# Altium schematic sheet module 6_MIC.SchDoc
size A4
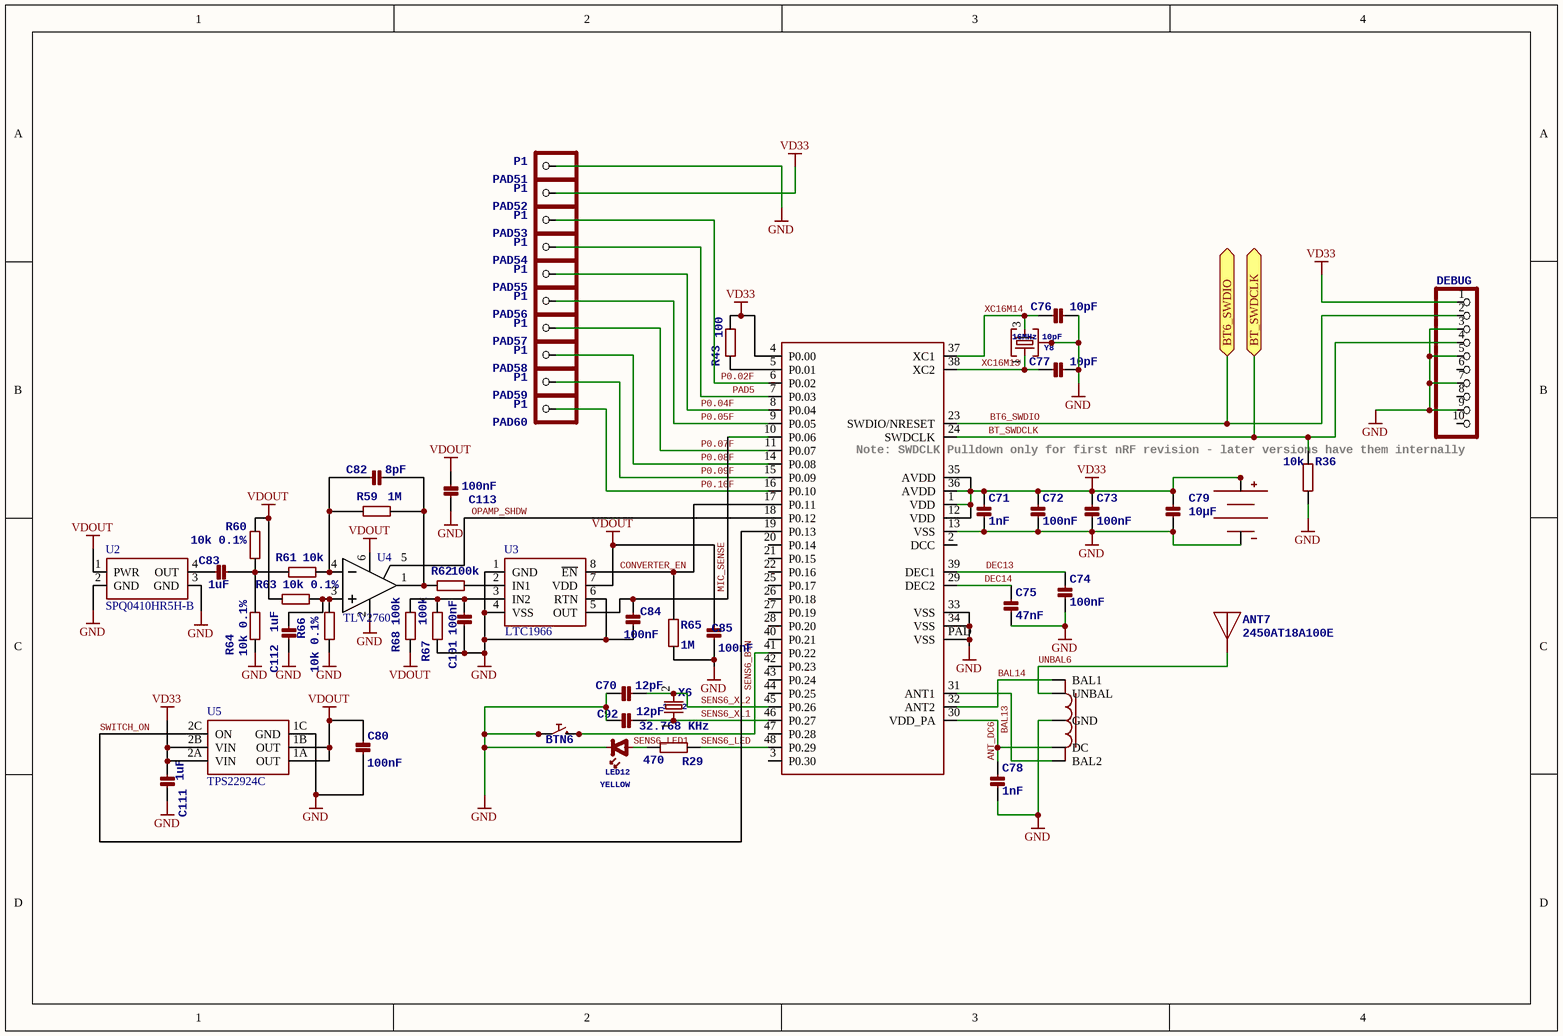
[diagram p0: module 6_MIC.SchDoc]

## Parts
ANT7  2450AT18A100E  [1206_MINIMELF_COMBO]
BALUN6  2450BM14A0002T  [6-PIN-0603]  (value not drawn)
BAT3  BATTERYBK-912  [BK-912]  (value not drawn)
BT6  NRF51822QFN48  [QFN48_EP]  (value not drawn)
BTN6  Tact Sw 4.6x2.8  [CK-KMR2]  (value not drawn)
C70  12pF  [0402]
C71  1nF  [0402]
C72  100nF  [0402]
C73  100nF  [0402]
C74  100nF  [0402]
C75  47nF  [0402]
C76  10pF  [0402]
C77  10pF  [0402]
C78  1nF  [0402]
C79  10µF  [0603]
C80  100nF  [0402]
C82  8pF  [0402]
C83  1uF  [0402]
C84  100nF  [0402]
C85  100nF  [0402]
C92  12pF  [0402]
C101  100nF  [0402]
C111  1uF  [0402]
C112  1uF  [0402]
C113  100nF  [0402]
DEBUG6  DEBUG  [2X05_SMT]  (no BOM)
LED12  YELLOW  [0402_POLAR]
PAD51  P1  [PCB_MEDIUM_RECT_PAD]  (no BOM)
PAD52  P1  [PCB_MEDIUM_RECT_PAD]  (no BOM)
PAD53  P1  [PCB_MEDIUM_RECT_PAD]  (no BOM)
PAD54  P1  [PCB_MEDIUM_RECT_PAD]  (no BOM)
PAD55  P1  [PCB_MEDIUM_RECT_PAD]  (no BOM)
PAD56  P1  [PCB_MEDIUM_RECT_PAD]  (no BOM)
PAD57  P1  [PCB_MEDIUM_RECT_PAD]  (no BOM)
PAD58  P1  [PCB_MEDIUM_RECT_PAD]  (no BOM)
PAD59  P1  [PCB_MEDIUM_RECT_PAD]  (no BOM)
PAD60  P1  [PCB_MEDIUM_RECT_PAD]  (no BOM)
R29  470  [0402]
R36  10k  [0402]
R43  100  [0402]
R59  1M  [0603]
R60  10k 0.1%  [0402]
R61  10k  [0603]
R62  100k  [0402]
R63  10k 0.1%  [0402]
R64  10k 0.1%  [0402]
R65  1M  [0402]
R66  10k 0.1%  [0402]
R67  100k  [0402]
R68  100k  [0402]
U2  SPQ0410HR5H-B  [SPQ0410HR5H-B]
U3  LTC1966  [MSOP-8]
U4  TLV2760  [DBV-6]
U5  TPS22924C  [YZP-6]
X6  32.768 KHz  [1206_MINIMELF_COMBO]
Y8  16MHz 10pF  [CRYSTAL25X20]

## Ports
BT6_SWDIO, BT_SWDCLK

## Nets
GND: BALUN6.2(GND) BAT3.- BT6.13(VSS) BT6.33(VSS) BT6.34(VSS) BT6.PAD(VSS) BTN6.P1 BTN6.P2 C70.1 C71.2 C72.2 C73.2 C74.2 C75.2 C76.2 C77.2 C78.2 C79.2(P2) C80.1 C84.1 C85.1 C92.1 C101.1 C111.2 C112.1 C113.1 DEBUG6.3 DEBUG6.5 DEBUG6.7 DEBUG6.9 LED12.K(CATHODE) PAD51.1 R36.1 R64.2 R65.2 R66.1 R67.1 U2.2(GND) U2.3(GND) U3.1(GND) U3.4(VSS) U3.6(RTN) U4.2(GND) U5.1C(GND) Y8.2 Y8.4
VD33: BAT3.+1(+) BAT3.+2(+) BT6.1(VDD) BT6.4(P0.00) BT6.12(VDD) BT6.35(AVDD) BT6.36(AVDD) C71.1 C72.1 C73.1 C79.1(P1) C111.1 DEBUG6.1 PAD52.1 R43.1 U5.2A(VIN) U5.2B(VIN)
VDOUT: C80.2 C85.2 C113.2 R60.1 R63.1 R68.1 U2.1(PWR) U3.7(VDD) U4.6(V+) U5.1A(OUT) U5.1B(OUT)
ANT_DC6: BALUN6.5(DC) BT6.30(VDD_PA) C78.1
BAL13: BALUN6.4(BAL2) BT6.31(ANT1)
BAL14: BALUN6.3(BAL1) BT6.32(ANT2)
BT6_SWDIO: BT6.23(SWDIO/NRESET) DEBUG6.2 ; port BT6_SWDIO
BT_SWDCLK: BT6.24(SWDCLK) DEBUG6.4 R36.2 ; port BT_SWDCLK
CONVERTER_EN: BT6.17(P0.11) R65.1 U3.8(~{EN})
DEC13: BT6.39(DEC1) C74.1
DEC14: BT6.29(DEC2) C75.1
MIC_SENSE: BT6.10(P0.06) C84.2 U3.5(OUT)
OPAMP_SHDW: BT6.18(P0.12) U4.5(~{SHD})
P0.02F: BT6.6(P0.02) PAD53.1
P0.04F: BT6.8(P0.04) PAD55.1
P0.05F: BT6.9(P0.05) PAD56.1
P0.07F: BT6.11(P0.07) PAD57.1
P0.08F: BT6.14(P0.08) PAD58.1
P0.09F: BT6.15(P0.09) PAD59.1
P0.10F: BT6.16(P0.10) PAD60.1
PAD5: BT6.7(P0.03) PAD54.1
SENS6_BTN: BT6.41(P0.22) BTN6.P3 BTN6.P4
SENS6_LED: BT6.48(P0.29) R29.1
SENS6_LED1: LED12.A(ANODE) R29.2
SENS6_XL1: BT6.46(P0.27) C92.2 X6.1
SENS6_XL2: BT6.45(P0.26) C70.2 X6.2
SWITCH_ON: BT6.19(P0.13) U5.2C(ON)
UNBAL6: ANT7.1(ANT) BALUN6.1(UNBAL)
XC16M13: BT6.38(XC2) C77.1 Y8.1
XC16M14: BT6.37(XC1) C76.1 Y8.3
NetBT6_5: BT6.5(P0.01) R43.2
NetC82_1: C82.1 R59.1 R61.2 U4.4(IN-)
NetC82_2: C82.2 R59.2 R62.1 U4.1(OUT)
NetC83_1: C83.1 R60.2 R61.1 R64.1
NetC83_2: C83.2 U2.4(OUT)
NetC101_2: C101.2 R67.2 R68.2 U3.3(IN2)
NetC112_2: C112.2 R63.2 R66.2 U4.3(IN+)
NetR62_2: R62.2 U3.2(IN1)

Not connected (* = marked no-connect by the designer): BT6 2(DCC) 3(P0.30) 20(P0.14) 21(P0.15) 22(P0.16) 25(P0.17) 26(P0.18) 27(P0.19) 28(P0.20) 40(P0.21) 42(P0.23) 43(P0.24) 44(P0.25) 47(P0.28); DEBUG6 6 8 10

## Notes on the sheet
- (near BT6) Note: SWDCLK Pulldown only for first nRF revision - later versions have them internally

## Library data of the parts
ANT7 = ANTENNA_MONOPOLE1206: 2.45 GHz Antenna; SMD: Yes
BALUN6 = BALUN: 2.45 GHz Impedance Matched Balun-Filter; SMD: Yes
BAT3 = BATTERYBK-912: Coin battery holder; SMD: Yes
BT6 = NRF51822QFN48: Nordic Bluetooth 4.0 low energy modul; SMD: Yes
BTN6 = PUSHBUTTONKMR2XX: Push button; SMD: Yes
C70-C78 C80 C82-C85 C92 C101 C111-C113 = CAP_CERAMIC0402: Ceramic Capacitors; SMD: Yes
C79 = CAP_CERAMIC0603: Ceramic Capacitor; SMD: Yes
DEBUG6 = HEADER-2X5SMD-1.27MM: cortex DEBUG connector
LED12 = LED0402: LED common; SMD: Yes
PAD51-PAD60 = HEADER-1X1SMD_MEDIUM: <b>PIN HEADER</b>
R29 R36 R43 R59-R68 = R-EU_0402: <B>RESISTOR</B>, European symbol; SMD: Yes
U2 = SPU0410HR5H-PB: SPQ0410HR5H-B mic; SMD: Yes
U3 = LTC1966: RMS-to-DC converter; SMD: Yes
U4 = TLV2760: TI OP-AMP; SMD: Yes
U5 = TPS22963: LOAD SWITCH; SMD: Yes
X6 = CRYSTAL1206: CL05C120JB5; 1: 1; 2: 2; SMD: Yes
Y8 = CRYSTAL_WITH_GROUND25X20: 16MHz crystal 2.5x2mm; SMD: Yes